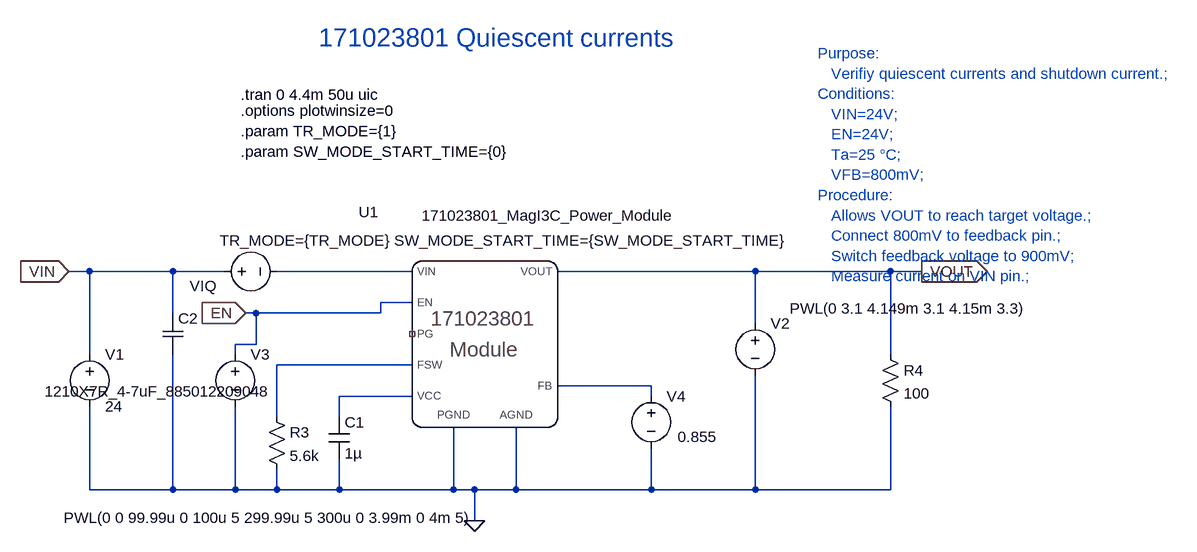
[diagram p0: schematic 171023801 Quiescent currents.asc]
171023801 Quiescent currents.asc, the LTspice schematic file:
Version 4
SHEET 1 1600 680
WIRE -384 48 -416 48
WIRE -256 48 -384 48
WIRE -176 48 -256 48
WIRE 112 48 -96 48
WIRE 640 48 336 48
WIRE 848 48 640 48
WIRE 896 48 848 48
WIRE 112 96 64 96
WIRE -256 112 -256 48
WIRE -128 112 -144 112
WIRE 64 112 64 96
WIRE 64 112 -128 112
WIRE 640 128 640 48
WIRE -128 160 -128 112
WIRE -128 160 -160 160
WIRE -384 176 -384 48
WIRE -160 176 -160 160
WIRE 848 176 848 48
WIRE 112 192 -96 192
WIRE 480 224 336 224
WIRE 112 240 0 240
WIRE 480 240 480 224
WIRE -96 272 -96 192
WIRE 0 272 0 240
WIRE -384 384 -384 256
WIRE -256 384 -256 176
WIRE -256 384 -384 384
WIRE -160 384 -160 256
WIRE -160 384 -256 384
WIRE -96 384 -96 352
WIRE -96 384 -160 384
WIRE 0 384 0 336
WIRE 0 384 -96 384
WIRE 176 384 176 288
WIRE 176 384 0 384
WIRE 208 384 176 384
WIRE 272 384 272 288
WIRE 272 384 208 384
WIRE 480 384 480 320
WIRE 480 384 272 384
WIRE 640 384 640 208
WIRE 640 384 480 384
WIRE 848 384 848 256
WIRE 848 384 640 384
WIRE 208 432 208 384
FLAG 208 432 0
FLAG -416 48 VIN
IOPIN -416 48 In
FLAG 896 48 VOUT
IOPIN 896 48 Out
FLAG -144 112 EN
IOPIN -144 112 In
SYMBOL res -112 256 R0
SYMATTR InstName R3
SYMATTR Value 5.6k
SYMBOL cap -16 272 R0
SYMATTR InstName C1
SYMATTR Value 1µ
SYMATTR SpiceLine Rser=7.13m Lser=257p
SYMBOL res 832 160 R0
SYMATTR InstName R4
SYMATTR Value 100
SYMBOL voltage -384 160 R0
WINDOW 123 0 0 Left 0
WINDOW 39 0 0 Left 0
SYMATTR InstName V1
SYMATTR Value 24
SYMBOL voltage 640 112 R0
WINDOW 123 24 124 Left 2
WINDOW 39 20 127 Left 2
WINDOW 3 53 -7 Left 2
SYMATTR Value PWL(0 3.1 4.149m 3.1 4.15m 3.3)
SYMATTR InstName V2
SYMBOL voltage -192 48 R270
WINDOW 123 0 0 Left 0
WINDOW 39 24 124 Left 2
WINDOW 0 -22 -38 VRight 2
SYMATTR InstName VIQ
SYMATTR Value ""
SYMBOL voltage -160 160 R0
WINDOW 123 24 124 Left 2
WINDOW 39 20 127 Left 2
WINDOW 3 -264 267 Left 2
SYMATTR Value PWL(0 0 99.99u 0 100u 5 299.99u 5 300u 0 3.99m 0 4m 5)
SYMATTR InstName V3
SYMBOL voltage 480 224 R0
WINDOW 123 24 124 Left 2
WINDOW 39 20 127 Left 2
WINDOW 3 41 79 Left 2
SYMATTR Value 0.855
SYMATTR InstName V4
SYMBOL WCAP-CSGP_50V_DCbias -272 112 R0
WINDOW 38 -181 121 Left 2
SYMATTR SpiceModel 1210X7R_4-7uF_885012209048
SYMATTR InstName C2
SYMBOL 171023801_MagI3C_Power_Module 256 64 R0
SYMATTR InstName U1
TEXT -32 -312 Left 4 ;171023801 Quiescent currents
TEXT 736 -288 Left 2 ;Purpose: \n   Verifiy quiescent currents and shutdown current.; \nConditions: \n   VIN=24V; \n   EN=24V; \n   Ta=25 °C; \n   VFB=800mV; \nProcedure: \n   Allows VOUT to reach target voltage.; \n   Connect 800mV to feedback pin.; \n   Switch feedback voltage to 900mV; \n   Measure current on VIN pin.;
TEXT -152 -224 Left 2 !.tran 0 4.4m 50u uic
TEXT -152 -200 Left 2 !.options plotwinsize=0
TEXT -152 -168 Left 2 !.param TR_MODE={1}\n.param SW_MODE_START_TIME={0}

The netlist it stands for:
* 171023801 Quiescent currents.asc
R3 N002 0 5.6k
C1 N004 0 1µ Rser=7.13m Lser=257p
R4 VOUT 0 100
V1 VIN 0 24
V2 VOUT 0 PWL(0 3.1 4.149m 3.1 4.15m 3.3)
VIQ VIN N001
V3 EN 0 PWL(0 0 99.99u 0 100u 5 299.99u 5 300u 0 3.99m 0 4m 5)
V4 N003 0 0.855
XC2 VIN 0 1210X7R_4-7uF_885012209048  ; pins A B
XU1 VOUT N003 N001 EN NC_01 N002 N004 0 0 171023801_MagI3C_Power_Module TR_MODE={TR_MODE} SW_MODE_START_TIME={SW_MODE_START_TIME}  ; pins VOUT FB VIN EN PG FSW VCC PGND AGND
* 171023801 Quiescent currents
* Purpose:
*    Verifiy quiescent currents and shutdown current.;
* Conditions:
*    VIN=24V;
*    EN=24V;
*    Ta=25 °C;
*    VFB=800mV;
* Procedure:
*    Allows VOUT to reach target voltage.;
*    Connect 800mV to feedback pin.;
*    Switch feedback voltage to 900mV;
*    Measure current on VIN pin.;
.tran 0 4.4m 50u uic
.options plotwinsize=0
.param TR_MODE={1}
.param SW_MODE_START_TIME={0}
.lib WCAP-CSGP_50V_DCbias.lib
.lib 171023801.lib
.backanno
.end